# EAGLE design band-psd-micro-standalone (EAGLE 7.2.0)
DATABASE: /Users/ingolia/Dropbox/Experiments/turbidostat/nephelometer/circuitry/partsdb.txt
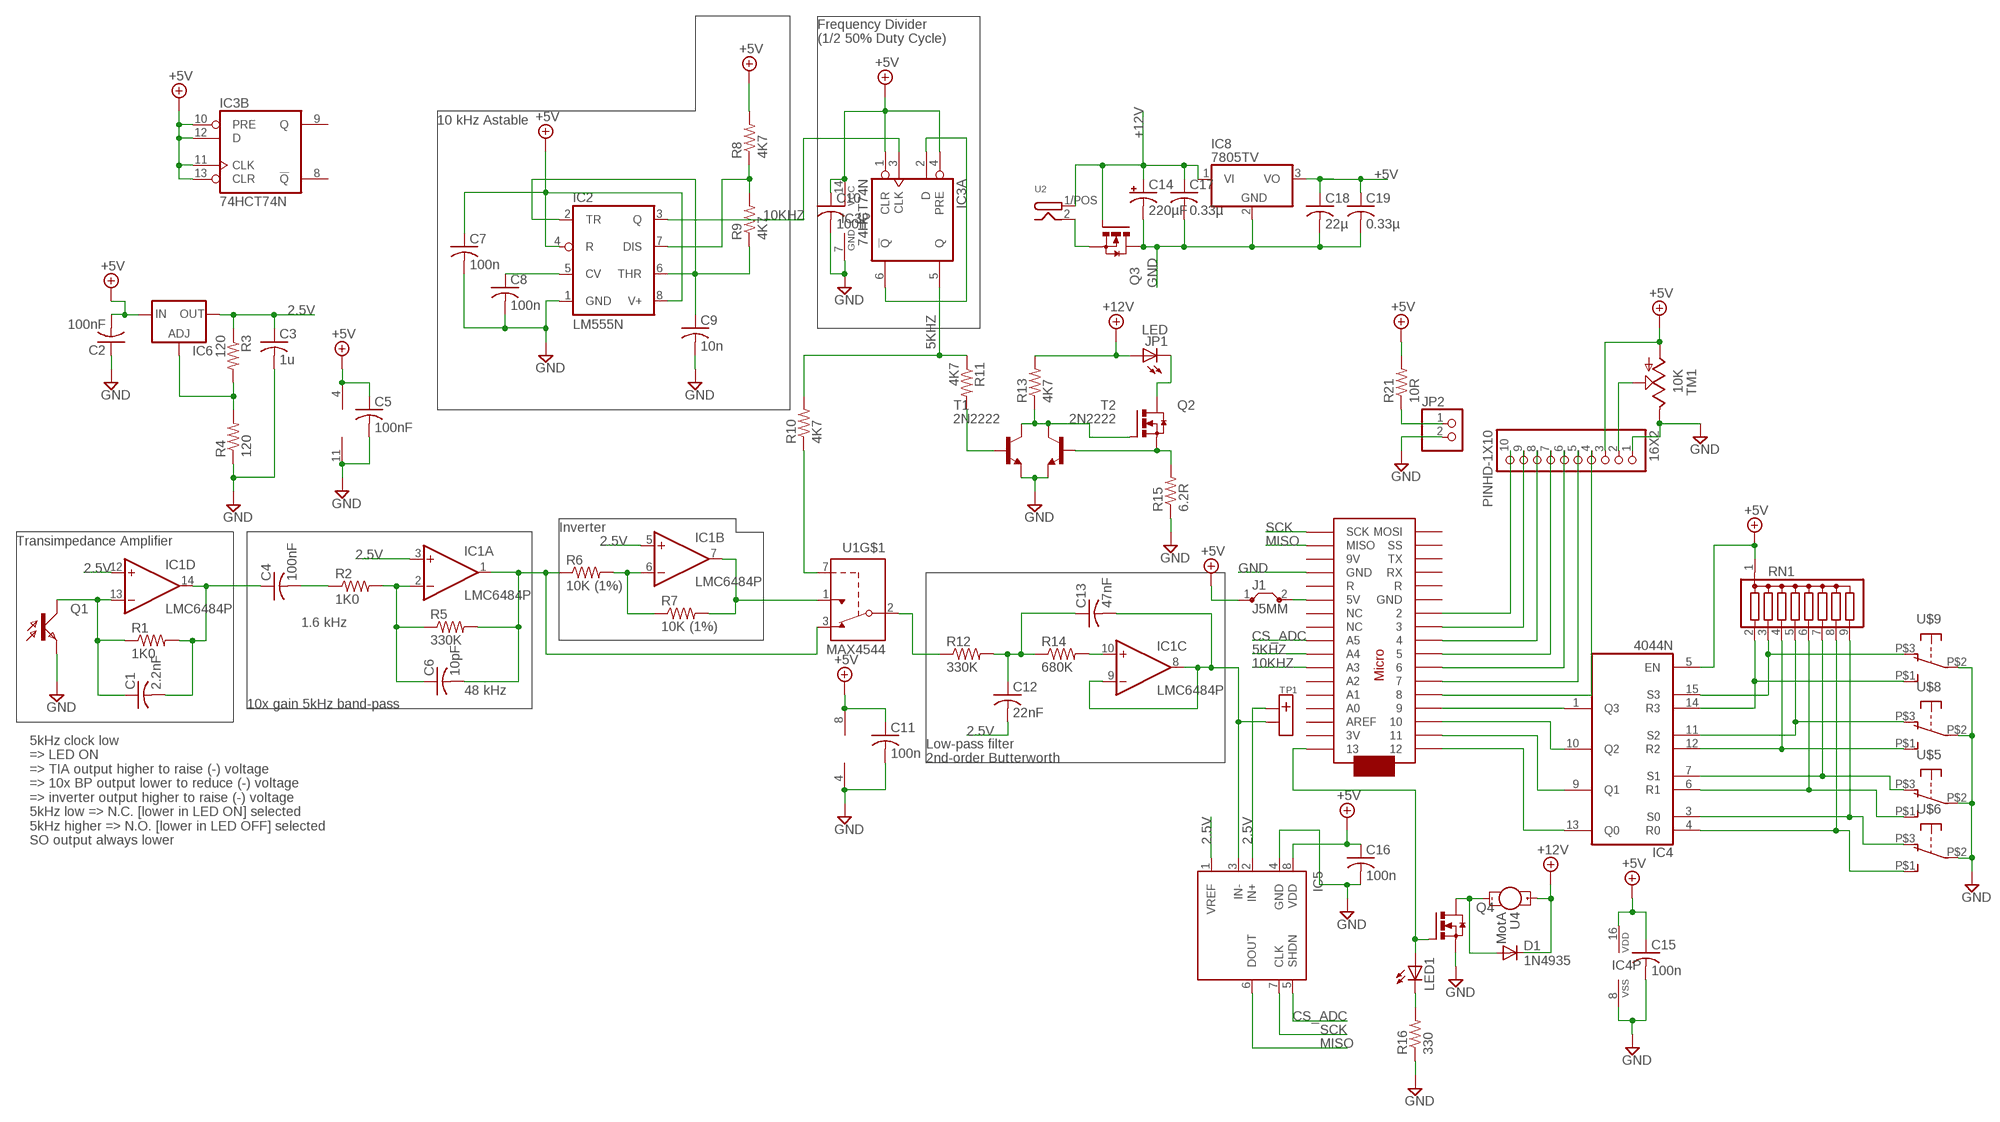
[diagram p0: schematic, sheet 1]

## Parts
16X2  PINHD-1X10  [1X10-BIG]
C1  2.2nF  C-US025-024X044  [C025-024X044]
C2  100nF  C-US025-025X050  [C025-025X050]
C3  1u  C-US050-024X044  [C050-024X044]
C4  100nF  C-US025-060X050  [C025-060X050]
C5  100nF  C-US025-025X050  [C025-025X050]
C6  10pF  C-US025-024X044  [C025-024X044]
C7  100n  C-US025-025X050  [C025-025X050]
C8  100n  C-US025-025X050  [C025-025X050]
C9  10n  C-US025-025X050  [C025-025X050]
C10  100n  C-US025-025X050  [C025-025X050]
C11  100n  C-US025-025X050  [C025-025X050]
C12  22nF  C-US025-024X044  [C025-024X044]
C13  47nF  C-US025-040X050  [C025-040X050]
C14  220µF  CPOL-USE3.5-8  [E3,5-8]
C15  100n  C-US025-025X050  [C025-025X050]
C16  100n  C-US025-025X050  [C025-025X050]
C17  0.33µ  C-US025-050X050  [C025-050X050]
C18  22µ  C-US050-045X075  [C050-045X075]
C19  0.33µ  C-US025-050X050  [C025-050X050]
D1  1N4935  1N4004  [DO41-10]
IC1  LMC6484P  [DIL14]
IC2  LM555N  [DIL08]
IC3  74HCT74N  [DIL14]
IC4  4044N  [DIL16]
IC5  MCP3301  [DIL08]
IC6  LM317L  [317L]
IC8  7805TV  [TO220V]
J1  J5MM  [05]
JP1  LED  LED_CXN  [1X02_SCREW]
JP2  PINHD-1X2  [1X02]
LED1  LED3MM  [LED3MM]
Q1  LTR-4206  [3MM_LED]
Q2  IRLB8721  [TO220BV]
Q3  IRLB8721  [TO220BV]
Q4  IRLB8721  [TO220BV]
R1  1K0  R-US_0204/5  [0204/5]
R2  1K0  R-US_0204/5  [0204/5]
R3  120  R-US_0204/2V  [0204V]
R4  120  R-US_0204/2V  [0204V]
R5  330K  R-US_0309/V  [0309V]
R6  10K (1%)  R-US_0204/5  [0204/5]
R7  10K (1%)  R-US_0204/5  [0204/5]
R8  4K7  R-US_0204/2V  [0204V]
R9  4K7  R-US_0204/2V  [0204V]
R10  4K7  R-US_0204/2V  [0204V]
R11  4K7  R-US_0204/2V  [0204V]
R12  330K  R-US_0204/2V  [0204V]
R13  4K7  R-US_0204/2V  [0204V]
R14  680K  R-US_0204/2V  [0204V]
R15  6.2R  R-US_0204/2V  [0204V]
R16  330  R-US_0204/2V  [0204V]
R21  10R  R-US_0204/2V  [0204V]
RN1  G08R  [SIL9]
T1  2N2222  [TO92-EBC-OVAL]
T2  2N2222  [TO92-EBC-OVAL]
TM1  10K  TRIM_US-B25P  [B25P]
TP1  TEST_POINT  [1X02_SCREW]
U1  MAX4544  [DIL08]
U2  DC-IN-PANEL-NODETECT  [1X02_SCREW]
U3  ARDUINOMICRO  [ARDUINOMICRO]
U4  MotA  1X02_MOTOR  [1X02_SCREW]
U$5  APE1F-5M-10-Z  [APE1F-5M-10Z]
U$6  APE1F-5M-10-Z  [APE1F-5M-10Z]
U$8  APE1F-5M-10-Z  [APE1F-5M-10Z]
U$9  APE1F-5M-10-Z  [APE1F-5M-10Z]

## Nets
2.5V: C3.1 C12.2 IC1.3(A:+IN) IC1.5(B:+IN) IC1.12(D:+IN) IC5.1(VREF) IC5.2(IN+) IC6.2(OUT) R3.1 TP1.1/POS(+)
5KHZ: IC3.5(A:Q) R10.2 R11.1 U3.P$27(A4)
10KHZ: IC2.3(Q) IC3.3(A:CLK) U3.P$28(A3)
+5V: 16X2.3 C2.2 C5.1 C7.1 C10.1 C11.1 C15.1 C16.1 C18.1 C19.1 IC1.4(P:V+) IC2.4(R) IC2.8(V+) IC3.1(A:CLR) IC3.4(A:PRE) IC3.10(B:PRE) IC3.11(B:CLK) IC3.12(B:D) IC3.13(B:CLR) IC3.14(P:VCC) IC4.5(EN) IC4.16(VDD) IC5.8(VDD) IC6.3(IN) IC8.3(VO) J1.1 R8.2 R21.2 RN1.1 TM1.A U1.8(V+)
+12V: C14.+ C17.1 D1.C IC8.1(VI) JP1.1/POS(A) Q3.G R13.2 U2.1/POS(PWR) U4.1/POS(+)
CS_ADC: IC5.5(SHDN) U3.P$26(A5)
GND: 16X2.1 C2.1 C3.2 C5.2 C7.2 C8.2 C9.2 C10.2 C11.2 C14.- C15.2 C16.2 C17.2 C18.2 C19.2 IC1.11(P:V-) IC2.1(GND) IC3.7(P:GND) IC4.8(VSS) IC5.4(GND) IC8.2(GND) JP2.2 Q1.A(E) Q3.D Q4.S R4.1 R15.1 R16.1 T1.E T2.E TM1.E U1.4(V-) U3.P$12(GND) U$5.P$2(COM) U$6.P$2(COM) U$8.P$2(COM) U$9.P$2(COM)
LEDCTRL: R11.2 T1.B
MISO: IC5.6(DOUT) U3.P$19(MISO)
N$1: C1.1 IC1.13(D:-IN) Q1.K(C) R1.1
N$2: C4.2 R2.1
N$3: D1.A Q4.D U4.2(-)
N$4: IC1.6(B:-IN) R6.2 R7.1
N$5: IC1.7(B:OUT) R7.2 U1.1(NO)
N$6: R12.1 U1.2(COM)
N$7: IC1.10(C:+IN) R14.2
N$8: Q2.G R13.1 T1.C T2.C
N$9: C9.1 IC2.2(TR) IC2.6(THR) R9.1
N$10: C8.1 IC2.5(CV)
N$11: IC4.9(Q1) U3.P$2
N$12: IC3.2(A:D) IC3.6(A:!Q)
N$13: IC2.7(DIS) R8.1 R9.2
N$14: Q2.S R15.2 T2.B
N$15: IC4.13(Q0) U3.P$1
N$16: LED1.K(C) R16.2
N$18: JP1.2(K) Q2.D
N$19: LED1.A Q4.G U3.P$34
N$20: 16X2.10 U3.P$11
N$21: JP2.1 R21.1
N$22: C1.2 C4.1 IC1.14(D:OUT) R1.2
N$23: R10.1 U1.7(IN)
N$24: 16X2.9 U3.P$10
N$25: C6.1 IC1.2(A:-IN) R2.2 R5.1
N$26: C6.2 IC1.1(A:OUT) R5.2 R6.1 U1.3(NC)
N$27: C12.1 C13.1 R12.2 R14.1
N$28: C13.2 IC1.8(C:OUT) IC1.9(C:-IN) IC5.3(IN-) TP1.2(-)
N$29: 16X2.8 U3.P$9
N$30: 16X2.7 U3.P$8
N$31: 16X2.6 U3.P$7
N$32: 16X2.5 U3.P$6
N$33: IC4.15(S3) RN1.3 U$9.P$3(NC)
N$34: IC4.14(R3) RN1.2 U$9.P$1(NO)
N$35: IC6.1(ADJ) R3.2 R4.2
N$36: IC4.11(S2) RN1.5 U$8.P$3(NC)
N$37: IC4.12(R2) RN1.4 U$8.P$1(NO)
N$38: 16X2.2 TM1.S
N$39: IC4.1(Q3) U3.P$4
N$40: IC4.6(R1) RN1.6 U$5.P$1(NO)
N$41: 16X2.4 U3.P$5
N$42: IC4.3(S0) RN1.9 U$6.P$3(NC)
N$43: IC4.4(R0) RN1.8 U$6.P$1(NO)
N$44: IC4.7(S1) RN1.7 U$5.P$3(NC)
N$45: IC4.10(Q2) U3.P$3
N$46: J1.2 U3.P$23(5V)
N$47: Q3.S U2.2(GND)
SCK: IC5.7(CLK) U3.P$18(SCK)
Unconnected: IC3.8(B:!Q) IC3.9(B:Q) U3.P$13(R) U3.P$14(RX) U3.P$15(TX) U3.P$16(SS) U3.P$17(MOSI) U3.P$20(9V) U3.P$21(GND) U3.P$22(R) U3.P$24(NC) U3.P$25(NC) U3.P$29(A2) U3.P$30(A1) U3.P$31(A0) U3.P$32(AREF) U3.P$33(3V)

## Notes on the sheet
- Frequency Divider
  (1/2 50% Duty Cycle)
- 10 kHz Astable
- Inverter
- Transimpedance Amplifier
- 1.6 kHz
- 48 kHz
- 10x gain 5kHz band-pass
- 5kHz clock low
  => LED ON
  => TIA output higher to raise (-) voltage
  => 10x BP output lower to reduce (-) voltage
  => inverter output higher to raise (-) voltage
  5kHz low => N.C. [lower in LED ON] selected
  5kHz higher => N.O. [lower in LED OFF] selected
  SO output always lower
- Low-pass filter
  2nd-order Butterworth

## Library data of the parts
16X2 = adafruit:PINHD-1X10: Pin header 1x10 0.1" spacing With round pins
C1 = adafruit:C-US: CAPACITOR, American symbol; DIGIKEY#: BC1029CT-ND; MANF: Vishay BC Components; MANF#: K222J15C0GF5TL2
C2 = adafruit:C-US: CAPACITOR, American symbol; DIGIKEY#: BC1084CT-ND; MANF: Vishay BC Components; MANF#: K104K15X7RF5TL2
C3 = adafruit:C-US: CAPACITOR, American symbol; DIGIKEY#: 445-8614-ND; MANF: TDK Corporation; MANF#: FK28X7R1C105K
C4 = adafruit:C-US: CAPACITOR, American symbol; DIGIKEY#: 445-8325-ND; MANF: TDK Corporation; MANF#: FK16C0G1H104J
C5 C7 C8 C10 C11 C15 C16 = adafruit:C-US: CAPACITOR, American symbol; DIGIKEY#: BC1084CT-ND
C6 = adafruit:C-US: CAPACITOR, American symbol; DIGIKEY#: BC1001CT-ND; MANF: Vishay BC Components; MANF#: K100J15C0GF5TL2
C9 = adafruit:C-US: CAPACITOR, American symbol; DIGIKEY#: 445-8384-ND; MANF: TDK Corporation; MANF#: FK18C0G1H103J
C12 = adafruit:C-US: CAPACITOR, American symbol; DIGIKEY#: 445-8280-ND; MANF: TDK Corporation; MANF#: FK14C0G1H223J
C13 = adafruit:C-US: CAPACITOR, American symbol; DIGIKEY#: 445-8327-ND; MANF: TDK Corporation; MANF#: FK16C0G1H473J
C14 = adafruit:CPOL-US: POLARIZED CAPACITOR, American symbol; DIGIKEY#: P5166-ND; MANF: Panasonic Electronic Components; MANF#: ECA-1VM221
C17 C19 = adafruit:C-US: CAPACITOR, American symbol; DIGIKEY#: 445-5312-ND; MANF: TDK Corporation; MANF#: FK14X7R1H334K
C18 = adafruit:C-US: CAPACITOR, American symbol; DIGIKEY#: 445-8455-ND; MANF: TDK Corporation; MANF#: FK20X7R1C226M
D1 = adafruit:1N4004: DIODE General purpose 1N400x type rectifier (With bigger pads) http://www.ladyada.net/library/pcb/eaglelibrary.html; DIGIKEY#: 1N4935FSCT-ND; MANF: Fairchild Semiconductor; MANF#: 1N4935
IC1 = ingolia:LMC6484: SoundPLUS (TM) High Performance AUDIO OPERATIONAL AMPLIFIERS Source: http://focus.ti.com/lit/ds/sbos058/sbos058.pdf; DIGIKEY#: LMC6484AIN/NOPB-ND; DIGIKEY2#: AE10012-ND; MANF: Texas Instruments; MANF#: LMC6484AIN/NOPB
IC2 = linear:*555: TIMER; DIGIKEY#: LM555CNFS-ND; DIGIKEY2#: AE9986-ND; MANF: Fairchild Semiconductor; MANF#: LM555CN
IC3 = 74xx-eu:74*74: Dual D type positive edge triggered FLIP FLOP, preset and clear; DIGIKEY#: 296-1625-5-ND; DIGIKEY2#: AE10012-ND; MANF: Texas Instruments; MANF#: SN74HCT74N
IC4 = 40xx:4044: Quad 3-state NAND R/S LATCH; DIGIKEY#: 296-2051-5-ND; DIGIKEY2#: AE9992-ND; MANF: Texas Instruments; MANF#: CD4044BE
IC5 = ingolia:MCP3301; DIGIKEY#: MCP3301-BI/P-ND; DIGIKEY2#: AE9986-ND; MANF: Microchip Technology; MANF#: MCP3301-BI/P
IC6 = v-reg:LM317L: VOLTAGE REGULATOR; DIGIKEY#: 296-33312-5-ND; MANF: Texas Instruments; MANF#: LM317LCLP
IC8 = linear:78*: Positive VOLTAGE REGULATOR Source: http://cache.national.com/ds/LM/LM78L05.pdf http://www.fairchildsemi.com/ds/LM/LM7805.pdf; DIGIKEY#: LM7805CT-ND; MANF: Fairchild Semiconductor; MANF#: LM7805CT
J1 = jumper:J: Bridge; DIGIKEY#: 0.0EBK-ND; MANF: Yageo; MANF#: ZOR-12-B-52-0R
JP1 = ingolia:LED_CXN; DIGIKEY#: 475-3002-ND; DIGIKEY2#: 492-1502-ND; MANF: OSRAM Opto Semiconductors Inc; MANF#: SFH 4547; MANF2: Bivar Inc; MANF2#: CR-174
JP2 = pinhead:PINHD-1X2: PIN HEADER
LED1 = adafruit:LED: LED OSRAM: - CHIPLED LG R971, LG N971, LY N971, LG Q971, LY Q971, LO R971, LY R971 LH N974, LH R974 LS Q976, LO Q976, LY Q976 LO Q996 - Hyper CHIPLED LW Q18S LB Q993, LB Q99A, LB R99A - SideLED LS A670, LO A670, LY A670, LG A670, LP A670 LB A673, LV A673, LT A673, LW A673 LH A674 LY A675 LS A676, LA A676, LO A676, LY A676, LW A676 LS A679, LY A679, LG A679 - Hyper Micro SIDELED® LS Y876, LA Y876, LO Y876, LY Y876 LT Y87S - SmartLED LW L88C, LW L88S LB L89C, LB L89S, LG L890 LS L89K, LO L89K, LY L89K LS L896, LA L896, LO L896, LY L896 - TOPLED LS T670, LO T670, LY T670, LG T670, LP T670 LSG T670, LSP T670, LSY T670, LOP T670, LYG T670 LG T671, LOG T671, LSG T671 LB T673, LV T673, LT T673, LW T673 LH T674 LS T676, LA T676, LO T676, LY T676, LB T676, LH T676, LSB T676, LW T676 LB T67C, LV T67C, LT T67C, LS T67K, LO T67K, LY T67K, LW E67C LS E67B, LA E67B, LO E67B, LY E67B, LB E67C, LV E67C, LT E67C LW T67C LS T679, LY T679, LG T679 LS T770, LO T770, LY T770, LG T770, LP T770 LB T773, LV T773, LT T773, LW T773 LH T774 LS E675, LA E675, LY E675, LS T675 LS T776, LA T776, LO T776, LY T776, LB T776 LHGB T686 LT T68C, LB T68C - Hyper Mini TOPLED® LB M676 - Mini TOPLED Santana® LG M470 LS M47K, LO M47K, LY M47K Source: http://www.osram.convergy.de/; DIGIKEY#: 160-1139-ND; MANF: Lite-On Inc; MANF#: LTL-4221N
Q1 = ingolia:LTR-4206; DIGIKEY#: 160-1030-ND; MANF: Lite-On Inc; MANF#: LTR-4206E
Q2 = ingolia:IRLB8721; DIGIKEY#: IRLB8721PBF-ND
Q3 Q4 = ingolia:IRLB8721; DIGIKEY#: IRLB8721PBF-ND; MANF: International Rectifier; MANF#: IRLB8721PBF
R1 R2 = adafruit:R-US_: RESISTOR, American symbol; DIGIKEY#: S1KCACT-ND; MANF: Stackpole Electronics Inc; MANF#: RNMF14FTC1K00
R3 R4 = adafruit:R-US_: RESISTOR, American symbol; DIGIKEY#: S120CACT-ND; MANF: Stackpole Electronics Inc; MANF#: RNMF14FTC120R
R5 R12 = adafruit:R-US_: RESISTOR, American symbol; DIGIKEY#: RNV14FAL330KCT-ND; MANF: Stackpole Electronics Inc; MANF#: RNV14FAL330K
R6 R7 = adafruit:R-US_: RESISTOR, American symbol; DIGIKEY#: S10KCACT-ND; MANF: Stackpole Electronics Inc; MANF#: RNMF14FTC10K0
R8 R9 = adafruit:R-US_: RESISTOR, American symbol; DIGIKEY#: S4.7KCACT-ND; MANF: Stackpole Electronics Inc; MANF#: RNMF14FTC4K70
R10 R11 R13 = adafruit:R-US_: RESISTOR, American symbol; DIGIKEY#: S4.7KQCT-ND; MANF: Stackpole Electronics Inc; MANF#: CFM14JT4K70
R14 = adafruit:R-US_: RESISTOR, American symbol; DIGIKEY#: S680KCACT-ND; MANF: Stackpole Electronics Inc; MANF#: RNMF14FTC680K
R15 = adafruit:R-US_: RESISTOR, American symbol; DIGIKEY#: PPC6.2W-1CT-ND; MANF: Vishay BC Components; MANF#: PR01000106208JR500
R16 = adafruit:R-US_: RESISTOR, American symbol; DIGIKEY#: CF14JT330RCT-ND; MANF: Stackpole Electronics Inc; MANF#: CF14JT330R
R21 = adafruit:R-US_: RESISTOR, American symbol
RN1 = resistor-sil:G08R: SIL RESISTOR; DIGIKEY#: 4609X-101-103LF-ND; MANF: Bourns Inc.; MANF#: 4609X-101-103LF; OC_FARNELL: unknown; OC_NEWARK: unknown
T1 T2 = adafruit:2N2222: NPN TRANSISTOR Big oval pads; DIGIKEY#: PN2222ATFCT-ND; MANF: Fairchild Semiconductor; MANF#: PN2222ATF
TM1 = pot:TRIM_US-: POTENTIOMETER; DIGIKEY#: 3386P-103LF-ND; MANF: Bourns Inc.; MANF#: 3386P-1-103LF
TP1 = ingolia:TEST_POINT
U1 = ingolia:MAX4544; DIGIKEY#: MAX4544CPA+-ND; DIGIKEY2#: AE9986-ND; MANF: Maxim Integrated; MANF#: MAX4544CPA+
U2 = ingolia:DC-IN-PANEL-NODETECT; DIGIKEY#: CP-5-ND; MANF: CUI Inc; MANF#: PJ-005A
U3 = adafruit:ARDUINOMICRO; DIGIKEY#: 1050-1066-ND; DIGIKEY2#: S7050-ND x 2; MANF: Arduino; MANF#: A000053; MANF2: Sullins Connector Solutions; MANF2#: PPPC171LFBN-RC
U4 = ingolia:1X02_MOTOR; DIGIKEY#: SC1455-ND; MANF: Switchcraft Inc.; MANF#: 35PM1
U$5 U$6 U$8 = ingolia:APE1F-5M-10-Z; DIGIKEY#: 563-1183-ND
U$9 = ingolia:APE1F-5M-10-Z; DIGIKEY#: 563-1183-ND; MANF: Copal Electronics Inc; MANF#: APE1F-5M-10-Z

## Board
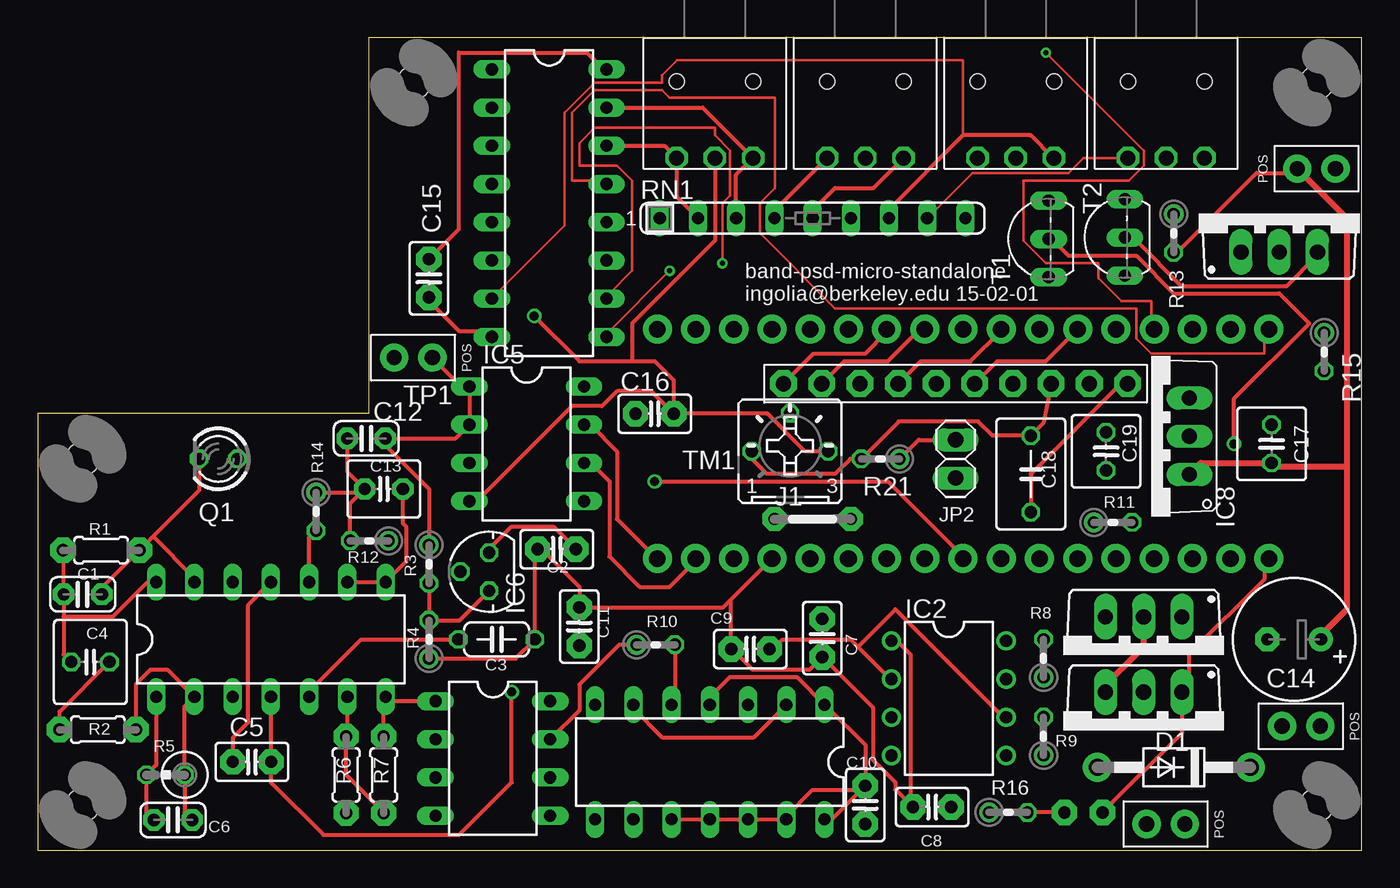
[diagram p1: board, top side]
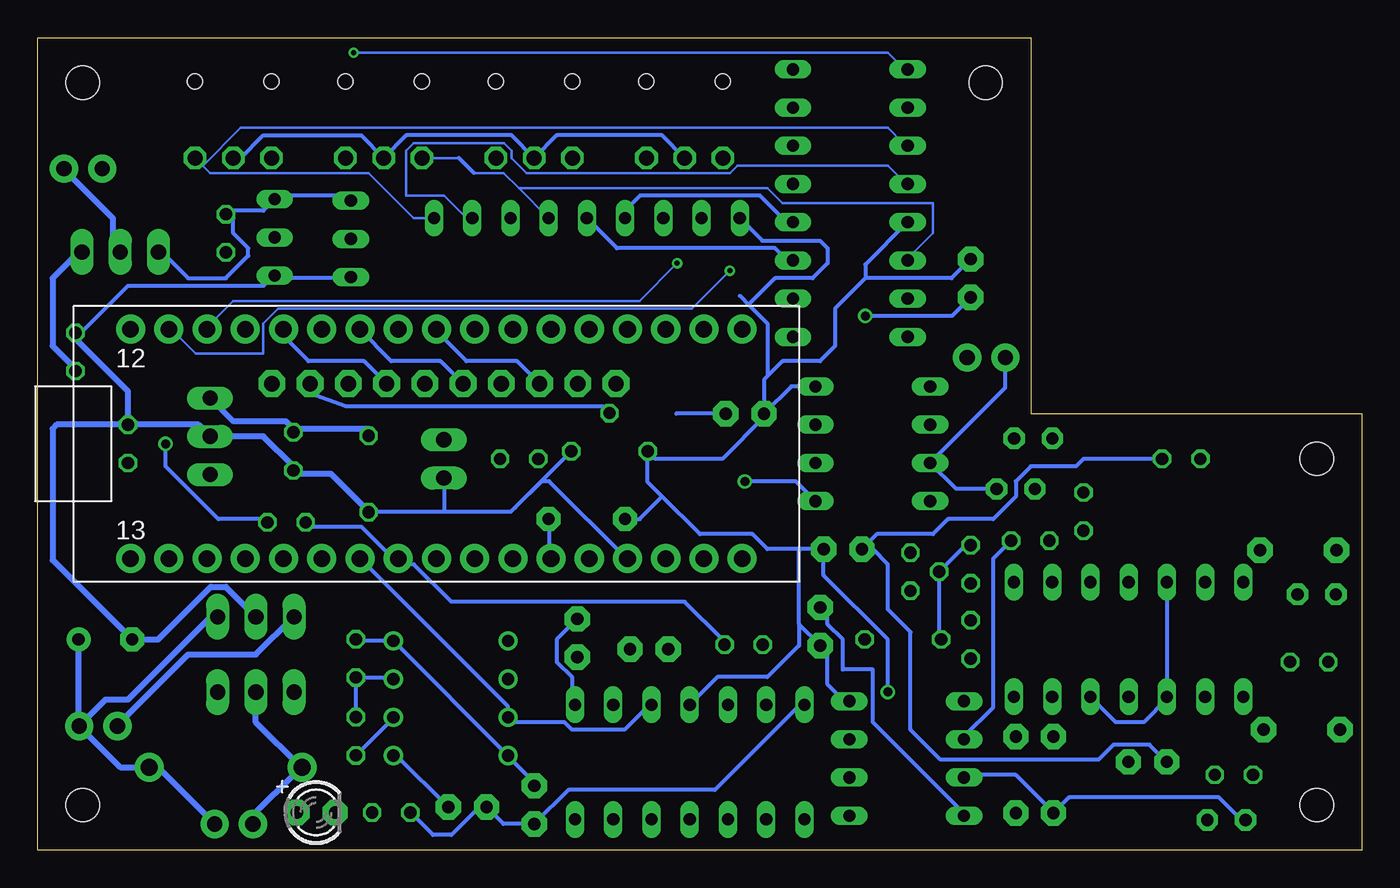
[diagram p2: board, bottom side, seen from below]

Size 88 x 54 mm. Coordinates in mm from the lower left corner, seen from the top.
Outline: 0,0 88,0 88,54 22,54 22,29 0,29 0,0
Copper layers (1*16): Top 0.0356mm / dielectric 1.5011mm / Bottom 0.0356mm
Design rules "OSHPark-LaenPCBOrder": minimum track width 6mil, minimum drill 13mil, track to track 6mil, track to pad 6mil, pad to pad 6mil, via to via 6mil, smd to smd 6mil, copper to edge 15mil, drill to drill 6mil, minimum pad ring 7mil, minimum via ring 7mil, stop-mask expansion 3mil, vias tented up to drill 0mil, thermal gap 10mil
tKeepout: area 7,21 to 17,29

### Footprints (pad centres in the part's own frame; a part is rotated, then mirrored left to right if it is on the bottom)
1X10-BIG = drill 1.016 pad 1.778 octagon: 1 -11.43,0; 2 -8.89,0; 3 -6.35,0; 4 -3.81,0; 5 -1.27,0; 6 1.27,0; 7 3.81,0; 8 6.35,0; 9 8.89,0; 10 11.43,0
C025-024X044 = drill 0.813 pad 1.422 octagon: 1 -1.27,0; 2 1.27,0
C025-025X050 = drill 0.813 pad 1.676 octagon: 1 -1.27,0; 2 1.27,0
C050-024X044 = drill 0.813 octagon: 1 -2.54,0; 2 2.54,0
C025-060X050 = drill 0.813 octagon: 1 -1.27,0; 2 1.27,0
C025-040X050 = drill 0.813 pad 1.422 octagon: 1 -1.27,0; 2 1.27,0
E3,5-8 = drill 0.813 pad 1.6: + -1.778,0 | drill 0.813 pad 1.6 octagon: - 1.778,0
C025-050X050 = drill 0.813 octagon: 1 -1.27,0; 2 1.27,0
C050-045X075 = drill 0.813 octagon: 1 -2.54,0; 2 2.54,0
DO41-10 = drill 1.118 pad 1.93: A 5.08,0; C -5.08,0
DIL14 = drill 0.813 long: 1 -7.62,-3.81; 2 -5.08,-3.81; 3 -2.54,-3.81; 4 0,-3.81; 5 2.54,-3.81; 6 5.08,-3.81; 7 7.62,-3.81; 8 7.62,3.81; 9 5.08,3.81; 10 2.54,3.81; 11 0,3.81; 12 -2.54,3.81; 13 -5.08,3.81; 14 -7.62,3.81
DIL08 = drill 0.813 pad 1.27: 1 -3.81,-3.81; 2 -1.27,-3.81; 3 1.27,-3.81; 4 3.81,-3.81; 5 3.81,3.81; 6 1.27,3.81; 7 -1.27,3.81; 8 -3.81,3.81
DIL16 = drill 0.813 long: 1 -8.89,-3.81; 2 -6.35,-3.81; 3 -3.81,-3.81; 4 -1.27,-3.81; 5 1.27,-3.81; 6 3.81,-3.81; 7 6.35,-3.81; 8 8.89,-3.81; 9 8.89,3.81; 10 6.35,3.81; 11 3.81,3.81; 12 1.27,3.81; 13 -1.27,3.81; 14 -3.81,3.81; 15 -6.35,3.81; 16 -8.89,3.81
DIL08' = drill 0.813 long: 1 -3.81,-3.81; 2 -1.27,-3.81; 3 1.27,-3.81; 4 3.81,-3.81; 5 3.81,3.81; 6 1.27,3.81; 7 -1.27,3.81; 8 -3.81,3.81
317L = drill 0.813 octagon: 1 -1.27,0; 2 0,1.905; 3 1.27,0
TO220V = drill 1.016 long: 1 -2.54,-2.54; 2 0,-2.54; 3 2.54,-2.54
05 = drill 0.813 pad 1.6 octagon: 1 -2.54,0; 2 2.54,0
1X02_SCREW = drill 1.016 pad 1.88: 1/POS 1.27,1.27; 2 3.81,1.27
1X02 = drill 1.016 long: 1 -1.27,0; 2 1.27,0
LED3MM = drill 0.813 pad 1.676 octagon: A -1.27,0; K 1.27,0
3MM_LED = drill 0.813 octagon: A -1.27,0; K 1.27,0
TO220BV = drill 1.016 long: D 0,0; G -2.54,0; S 2.54,0
0204/5 = drill 0.813 pad 1.676 octagon: 1 -2.54,0; 2 2.54,0
0204V = drill 0.813 octagon: 1 -1.27,0; 2 1.27,0
0309V = drill 0.813 octagon: 1 -1.27,0; 2 1.27,0
SIL9 = drill 0.813 long: 1 -10.16,0; 2 -7.62,0; 3 -5.08,0; 4 -2.54,0; 5 0,0; 6 2.54,0; 7 5.08,0; 8 7.62,0; 9 10.16,0
TO92-EBC-OVAL = drill 0.813 long: B 0,-1.27; C 2.54,-1.27; E -2.54,-1.27
B25P = drill 0.813 octagon: A -2.54,0; E 2.54,0; S 0,2.54
ARDUINOMICRO = drill 1.1 pad 1.93: P$1 -20.32,7.62; P$2 -17.78,7.62; P$3 -15.24,7.62; P$4 -12.7,7.62; P$5 -10.16,7.62; P$6 -7.62,7.62; P$7 -5.08,7.62; P$8 -2.54,7.62; P$9 0,7.62; P$10 2.54,7.62; P$11 5.08,7.62; P$12 12.7,-7.62; P$13 10.16,-7.62; P$14 12.7,7.62; P$15 15.24,7.62; P$16 17.78,7.62; P$17 20.32,7.62; P$18 20.32,-7.62; P$19 17.78,-7.62; P$20 15.24,-7.62; P$21 7.62,7.62; P$22 10.16,7.62; P$23 7.62,-7.62; P$24 5.08,-7.62; P$25 2.54,-7.62; P$26 0,-7.62; P$27 -2.54,-7.62; P$28 -5.08,-7.62; P$29 -7.62,-7.62; P$30 -10.16,-7.62; P$31 -12.7,-7.62; P$32 -15.24,-7.62; P$33 -17.78,-7.62; P$34 -20.32,-7.62
M2MOUNT = hole 2.2: 0,0
APE1F-5M-10Z = drill 1 octagon: P$1 -2.54,0; P$2 0,0; P$3 2.54,0 | hole 1: -2.54,5.08; 2.54,5.08

### Placement (x,y rotation side)
16X2  61,31 180 top
C1  3,17 180 top
C2  34.5,20 0 top
C3  30.5,14 0 top
C4  3.5,12.5 0 top
C5  14.24,5.86 180 top
C6  9,2 180 top
C7  52.14,14.09 270 top
C8  59.44,2.86 180 top
C9  47.36,13.36 180 top
C10  55,3 270 top
C11  35.99,14.86 90 top
C12  21.84,27.36 0 top
C13  23,24 0 top
C14  83.5,14 180 top
C15  26,38 270 top
C16  41,29 0 top
C17  82,27 90 top
C18  66,25 270 top
C19  71,26.5 270 top
D1  75.5,5.5 180 top
IC1  15.5,14 0 top
IC2  60.55,10.09 270 top
IC3  44.67,5.85 180 top
IC4  34,43 270 top
IC5  [DIL08']  32.5,27 270 top
IC6  30,18.5 90 top
IC8  74,27.5 90 top
J1  51.5,22 0 top
JP1  82.44,44.02 0 top
JP2  61,26 270 top
LED1  69.5,2.5 0 bottom
Q1  12,26 180 top
Q2  82.51,39.75 0 top
Q3  73.5,15.5 180 top
Q4  73.5,10.5 180 top
R1  4.22,19.93 180 top
R2  4,8 0 top
R3  26,19 270 top
R4  26,14 90 top
R5  8.5,5 180 top
R6  20.5,5 90 top
R7  23,5 90 top
R8  66.85,12.74 90 top
R9  66.85,7.56 90 top
R10  41.08,13.65 0 top
R11  71.46,21.78 0 top
R12  22.04,20.56 180 top
R13  75.49,40.99 270 top
R14  18.5,22.5 270 top
R15  85.49,33.11 270 top
R16  64.5,2.5 0 top
R21  56,26 180 top
RN1  51.5,42 0 top
T1  65.91,40.62 90 top
T2  70.98,40.72 90 top
TM1  50,26.5 0 top
TP1  27.5,34 180 top
U1  MAX4544  [DIL08']  30.25,6.09 270 top
U2  86.5,9.5 180 top
U3  61.5,27 0 bottom
U4  77.5,3 180 top
U$1  [M2MOUNT]  3,3 0 top
U$2  [M2MOUNT]  85,51 0 top
U$3  [M2MOUNT]  85,3 0 top
U$4  [M2MOUNT]  3,26 0 top
U$5  65,46 0 top
U$6  75,46 0 top
U$7  [M2MOUNT]  25,51 0 top
U$8  55,46 0 top
U$9  45,46 0 top

### Tracks (layer width: path | path; a pad name or v marks a point on that pad's centre or on a via)
2.5V
  Top 0.254: R3.1 26,24 23.11,26.89 C12.2 27.78,27.36 IC5.2 IC5.1 28.15,30.81 TP1.1/POS | IC1.5 18.04,10.54 21.5,14 C3.1
  Bottom 0.254: C3.1 28.09,14.14 IC6.2 26.32,20.27 R3.1 | IC1.12 IC1.3 12.96,10.04 14.5,8.5 16.35,8.5 IC1.5
5KHZ
  Top 0.254: R10.2 42.35,9.88 IC3.5
  Bottom 0.254: R10.2 42.5,14 45,16.5 60.5,16.5 63,19 64,19 U3.P$27 64.5,19.5 66.5,21.5 70,21.5 R11.1
10KHZ
  Bottom 0.254: U3.P$28 56.74,9.54 IC2.3 56.5,8.5 53,8.5 52.5,8 49,8 47.5,9.5 IC3.3
+5V  (via drill 0.6)
  Top 0.254: IC4.16 37.5,52 36.5,53 28,53 28,41.27 C15.1 | IC3.10 IC3.11 IC3.12 IC3.13 49.75,2.25 51.5,4 54.73,4 C10.1 | IC3.14 52.77,2.04 C10.1 | IC3.4 44.67,10.17 46,11.5 50.45,11.5 IC3.1 52.5,9.5 55,7 C10.1 | IC6.3 30,20 31.5,21.5 34.27,21.5 C2.2 | C5.1 IC1.4 15.5,4.5 19,1 28,1 31.5,4.5 v31.5,10.5 | 16X2.3 66.85,28.39 C18.1 63.46,27.54 62.5,28.5 57.23,28.5 R21.2 54,26 53,25 48.46,25 47.46,26 TM1.A
  Bottom 0.254: C16.1 39.73,28.77 42.5,26 46.96,26 TM1.A 47.46,24.46 46.5,23.5 | R8.2 66.74,13.9 IC2.8 IC2.4 56.5,6 55,4.5 C10.1 | C7.1 53.5,14 53.5,12.5 52.5,11.5 52.5,10 IC3.1 | U1.8 34.5,10 35.5,11 35.5,13.5 C11.1 37.4,15 | C16.1 37.92,30.81 IC5.8 | v31.5,10.5 31.5,14 35.77,18.27 C2.2 37.5,20 | 37.5,20 39.5,20 40.5,21 44,21 46.5,23.5 | C15.1 27.27,38 33,38 | 33,38 35,36 35,33.5 36,32.5 38.5,32.5 39.5,31.5 | 39.5,31.5 39.73,31.27 C16.1 | IC4.5 33,38.92 33,38 | 37.4,15 37.4,19.9 37.5,20 | 37.4,15 37.4,13.6 39.5,11.5 42.83,11.5 IC3.4 | 41.34,36.84 40.75,36.25 | 40.75,36.25 39.5,35 39.5,31.5 | 46.5,23.5 48,22 J1.1 | RN1.1 39.84,40.5 36,40.5 35.5,40 35.5,39 36.5,38 39,38 40.75,36.25
  Bottom 0.406: 71,28 66,28 C18.1 | IC8.3 75,28.5 71.5,28.5 71,28 | 71,28 C19.1
+12V
  Top 0.254: R13.2 75.5,39.5 81,45 83.5,45 83.71,45.21 JP1.1/POS
  Top 0.406: 87,25.5 82.23,25.5 C17.1 77.31,25.73 IC8.1 | 87,25.5 87,16 85.28,14.28 C14.+ | JP1.1/POS 87,42 87,25.5
  Bottom 0.406: U2.1/POS 85.28,8.23 C14.+ | U2.1/POS 82.5,5.5 D1.C 80,5.5 U4.1/POS | Q3.G 76.5,15.5 82,10 83.5,10 85,8.5 U2.1/POS
CS_ADC  (via drill 0.6)
  Top 0.254: v41,24.5 56.5,24.5 61.5,19.5 U3.P$26
  Bottom 0.254: IC5.5 37.62,24.5 v41,24.5
GND  (via drill 0.6)
  Top 0.152: 26,36.5 C15.2
  Top 0.254: 26,36.5 28,34.5 30,34.5 IC4.8 | TM1.E 51,26.5 48.5,29 C16.2 | IC2.1 57.1,13.9 58,13 58,3.03 C8.2 57,4.03 57,4.5 55.5,6 55.5,9.5 52.18,12.82 C7.2 51.32,12 47.5,12 46.14,13.36 C9.2 46.09,16.67 | 46.09,16.67 U3.P$12 | 46.09,16.67 45.55,16.13 C11.2 36,17.5 33.5,20 C2.1 33.04,19.81 C3.2 31.77,12.73 R4.1 | C16.2 40.77,30.5 38.5,30.5 37.5,29.5 35.5,29.5 29.5,23.5 29,23.5 IC5.4 | IC1.11 14,16.31 14,8.5 12.97,7.47 C5.2 | v33,35.5 36,32.5 39.5,32.5 | 39.5,32.5 41,32.5 42.27,31.23 C16.2 | U$9.P$2 45,40.5 39.5,35 39.5,32.5 | 16X2.1 71.93,30.93 66,25 C18.2
  Top 0.406: Q3.D 73.5,13.5 70.5,10.5 Q4.S
  Bottom 0.254: T1.E 67.5,38 72,38 T2.E 72.5,38 73,37.5 82,37.5 85,34.5 R15.1 | 66,22.5 61,22.5 | 61,22.5 56.54,22.5 56.27,22.77 | 56.27,22.77 TM1.E | U3.P$12 48.88,19.38 54,24.5 54.5,24.5 56.27,22.77 | C16.2 45.57,29 | IC3.7 37.55,9.45 43,4 52.73,4 C10.2 57.04,1.73 C8.2 58.64,2.86 60.5,1 61.73,1 R16.1 | U1.4 26.5,2.5 32.5,8.5 32.5,12 34.5,12 34.5,14 35.5,15 35.5,16 C11.2 | U$6.P$2 74.5,46 73,47.5 66.5,47.5 U$5.P$2 63.5,47.5 56.5,47.5 U$8.P$2 53.5,47.5 46.5,47.5 U$9.P$2 | Q1.A 18.5,26 19,25.5 22,25.5 23,24.5 23,23.5 24.5,22 27.5,22 28.5,21 32.23,21 C2.1 32.5,20 31.5,19 31.5,16 30,14.5 30,8 28,6 17.5,6 16.5,7 14.11,7 C5.2 | JP2.2 61,22.5 | C15.2 27.23,35.5 v33,35.5
  Bottom 0.406: Q3.D 75.5,17.5 76.5,17.5 80,14 C14.- 87,19.28 87,28 86.73,28.27 82.5,28.27 | R15.1 85.5,34 82,30.5 82,28.77 82.5,28.27 | C18.2 66,22.5 68.5,25 71,25 C19.2 71,25.5 73,27.5 IC8.2 77.31,28.27 C17.2 82.5,28.27
LEDCTRL  (via drill 0.6)
  Top 0.254: 73,22 R11.2 | T1.B 67.5,40.5 68.5,39.5 73,39.5 75.5,37 82.5,37 84.5,35 79.5,30 v79.5,27
  Bottom 0.254: v79.5,27 79.5,25.5 76,22 73,22 R11.2
MISO
  Top 0.254: U3.P$19 43.5,19 42,17.5 40,17.5 38,19.5 38,24.5 36.77,25.73 IC5.6
N$1
  Top 0.254: Q1.K 10.73,23.9 7.67,20.84 | 7.67,20.84 R1.1 4.27,17.44 C1.1 | IC1.13 10.42,18.08 7.67,20.84
N$2
  Top 0.254: R2.1 1.46,9.19 C4.2
N$3
  Bottom 0.406: 70.5,5.5 74,2 U4.2 | Q4.D 73.5,8.5 70.5,5.5 | 70.5,5.5 D1.A
N$4
  Top 0.254: IC1.6 20.58,7.62 R6.2 20.5,5 23,2.5 R7.1
N$5
  Top 0.254: R7.2 23,10.07 IC1.7 23.41,9.9 U1.1
N$6
  Bottom 0.254: U1.2 26.44,7.56 24.5,9.5 24.5,19.37 R12.1
N$7
  Top 0.254: IC1.10 18.04,20.77 R14.2
N$8
  Bottom 0.254: T1.C 67.5,43.5 72,43.5 T2.C 72.5,43 73,42.5 75,42.5 R13.1 75,42 75,41 74,40 74,39.5 75.5,38 78,38 79.5,39.5 Q2.G
N$9
  Top 0.254: C9.1 49,13.5 49.5,14 54,14 54.5,13.5 | 54.5,13.5 56.5,11.5 IC2.2 | IC2.6 64,9 57,16 54.5,13.5
  Bottom 0.254: IC2.6 64.36,8.78 R9.1
N$10
  Bottom 0.254: IC2.5 64.13,6.28 C8.1
N$11  (via drill 0.33)
  Top 0.152: v42,38.5 38,34.5 IC4.9
  Bottom 0.152: v42,38.5 44.5,36 72,36 73,35 73,33 77.5,33 79,34.5 U3.P$2
N$12
  Top 0.254: IC3.6 39.59,9.41 41.5,7.5 47.59,7.5 IC3.2
N$13
  Bottom 0.254: R9.2 R8.1 64.47,11.47 IC2.7
N$14
  Top 0.254: T2.B 73,40.5 76,37.5 83,37.5 85,39.5 Q2.S
  Bottom 0.406: R15.2 85.5,32 87,33.5 87,38 85.5,39.5 Q2.S
N$15
  Top 0.152: IC4.13 37.5,44.5 35.5,44.5 35.5,49 37,50.5 41.5,50.5 42,50 49,50 49,44 48,43 48,41 53,36 73,36 73,34 74,33 81.5,33 81.5,34.5 U3.P$1
N$16
  Top 0.254: LED1.K R16.2
N$18
  Bottom 0.406: Q2.D 83,40 83,42 86,45 JP1.2
N$19
  Top 0.254: U3.P$34 81.5,19 81.5,18 76.5,13 76.5,10.5 Q4.G 76.04,7.77 LED1.A
N$20
  Top 0.254: 16X2.10 51.57,33 55,33 56.42,34.42 U3.P$11
N$21
  Top 0.254: R21.1 58.54,27.27 JP2.1
N$22
  Top 0.254: R1.2 1.68,20.05 C1.2 1.73,15.5 | 1.73,15.5 1.73,13 C4.1 | IC1.14 7.31,17.81 5,15.5 1.73,15.5
N$23
  Top 0.254: R10.1 38.65,13.65 36,11 36,9.3 U1.7
N$24
  Top 0.254: 16X2.9 53.61,32.5 56.5,32.5 58.62,34.62 U3.P$10
N$25
  Top 0.254: R2.2 6.54,11.04 7.5,12 8.61,12 IC1.2 9.77,9.54 R5.1 9.77,2.5 C6.1
N$26
  Top 0.254: IC1.1 7.88,5.65 R5.2 7.23,2.5 C6.2
  Bottom 0.254: C6.2 8,2 9.5,3.5 19.46,3.5 R6.1 20.5,2.5 23,5 26.26,5 U1.3
N$27
  Top 0.254: R14.1 21.5,23.77 C13.1 | C12.1 20.57,25.16 C13.1 | R12.2 20.77,23.04 C13.1
N$28
  Top 0.254: IC1.9 IC1.8 24.5,19.19 24.5,21.5 24.27,21.73 C13.2
  Bottom 0.254: C13.2 26.96,24 IC5.3 23.69,30.73 TP1.2
N$29
  Bottom 0.254: 16X2.8 56.15,32.5 59.5,32.5 61.5,34.5 U3.P$9
N$30
  Top 0.254: 16X2.7 58.69,32.5 62,32.5 64.04,34.54 U3.P$8
N$31
  Bottom 0.254: 16X2.6 61.23,32.5 64.5,32.5 66.58,34.58 U3.P$7
N$32
  Top 0.254: 16X2.5 63.77,32.5 67,32.5 U3.P$6
N$33
  Top 0.254: RN1.3 46.42,44.88 U$9.P$3 44.19,49.35 IC4.15
N$34
  Top 0.254: RN1.2 42.46,43.42 U$9.P$1 41.65,46.81 IC4.14
N$35
  Top 0.254: R3.2 R4.2 28.04,15.27 IC6.1
N$36
  Top 0.254: RN1.5 51.5,42.5 53,44 55.54,44 U$8.P$3
  Bottom 0.254: IC4.11 38.19,39.19 39,40 49.5,40 RN1.5
N$37
  Top 0.254: RN1.4 48.96,42.5 U$8.P$1
  Bottom 0.254: IC4.12 38.23,41.73 40,43.5 47.96,43.5 48.96,42.5 RN1.4
N$38
  Bottom 0.254: 16X2.2 69.89,30.39 67.5,29.5 50.46,29.5 TM1.S
N$39  (via drill 0.33)
  Top 0.152: v67,53 73.5,46.5 73.5,45.5 72.5,44.5 65.5,44.5 65.5,40.5 67,39 70.5,39 70.5,38 72,36.5 74,36.5 74,35 U3.P$4
  Bottom 0.152: v67,53 31.5,53 30.5,52 IC4.1
N$40
  Bottom 0.152: U$5.P$1 60,46 | 59,45 57.04,45 56.02,43.98 | 56.02,43.98 RN1.6 | IC4.6 30,39.5 28.5,41 28.5,43 38.5,43 39.5,44 56,44 56.02,43.98
  Bottom 0.254: 60,46 59,45
N$41
  Bottom 0.254: 16X2.4 66.31,32.5 70,32.5 71.66,34.16 U3.P$5
N$42
  Bottom 0.152: RN1.9 63,42 66,45 76.54,45 U$6.P$3 77,45.5 74.5,48 31.5,48 30.5,47 IC4.3
N$43
  Top 0.152: U$6.P$1 69.5,46 68.5,45 62.12,45 RN1.8
  Bottom 0.152: IC4.4 30.5,44.5 31.5,45.5 41.5,45.5 42,45 55.5,45 56.5,46 56.5,46.5 57,47 63,47 63.5,46.5 63.5,43.5 61,43.5 59.5,42 RN1.8
N$44
  Top 0.152: 61.5,47.5 61.5,52.5 42.5,52.5 41.5,51.5 41.5,51 37,51 35,49 35,41.5 30.5,37 IC4.7
  Top 0.254: U$5.P$3 67.5,46 66,47.5 61.5,47.5 56.5,42.5 56.5,42.08 RN1.7
N$45  (via drill 0.33)
  Top 0.152: v45.5,39 45.5,43 46,43.5 46,46.5 45,47.5 45,48 37,48 36,47 36,45.5 38.5,45.5 39.5,44.5 39.5,38.5 38,37 IC4.10
  Bottom 0.152: v45.5,39 48,36.5 75,36.5 76.5,35 U3.P$3
N$46
  Bottom 0.254: U3.P$23 54,19.5 54,22 J1.2
N$47
  Bottom 0.406: Q3.S 71,15.5 73.5,13 78,13 82.5,8.5 U2.2
SCK
  Top 0.254: U3.P$18 41,19.5 38.5,22 38.5,26.5 36.73,28.27 IC5.7

### Text on the board
tPlace: band-psd-micro-standalone / ingolia@berkeley.edu 15-02-01